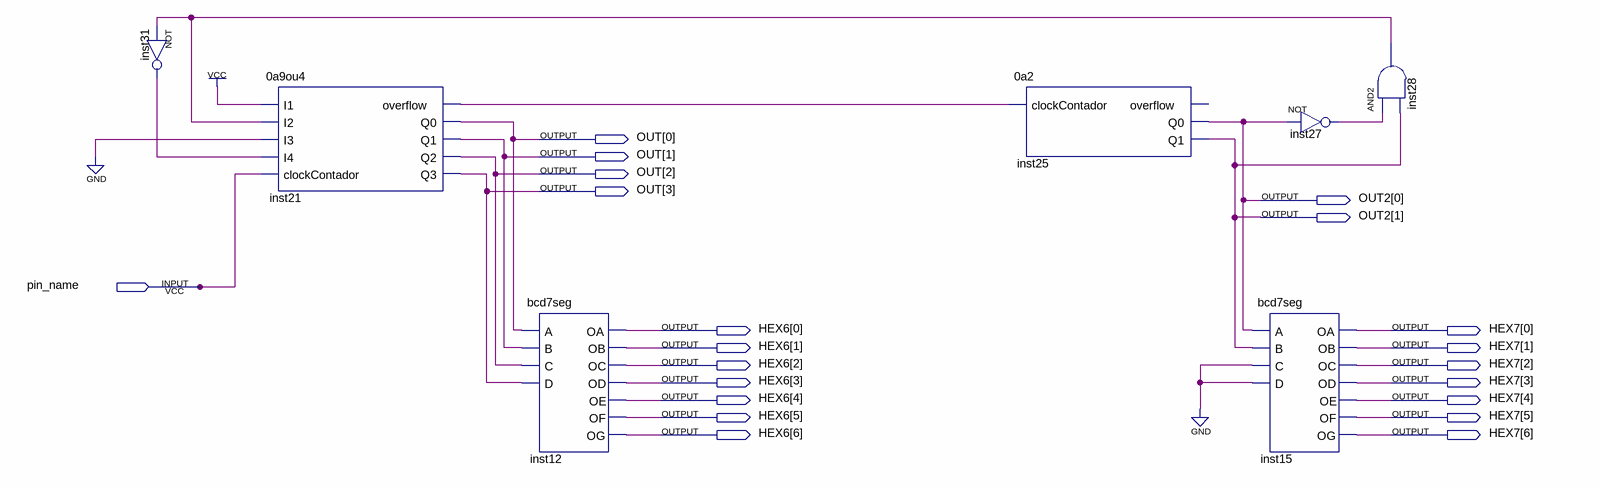
[diagram p0: schematic sheet]
// Quartus schematic exp13.bdf as structural Verilog: 7 symbols, 21 pins
module exp13 (
  input  pin_name,
  output [3:0] OUT,
  output [1:0] OUT2,
  output [6:0] HEX6,
  output [6:0] HEX7
);

  wire inst21_overflow, inst27_out, inst28_out, inst31_out;

  not inst31 (inst31_out, inst28_out);
  \0a9ou4  inst21 (
    .I1(1'b1), .I2(inst28_out), .I3(1'b0), .I4(inst31_out), .clockContador(pin_name),
    .overflow(inst21_overflow), .Q0(OUT[0]), .Q1(OUT[1]), .Q2(OUT[2]), .Q3(OUT[3]));
  bcd7seg inst12 (
    .A(OUT[0]), .B(OUT[1]), .C(OUT[2]), .D(OUT[3]), .OA(HEX6[0]), .OB(HEX6[1]), .OC(HEX6[2]), .OD(HEX6[3]),
    .OE(HEX6[4]), .OF(HEX6[5]), .OG(HEX6[6]));
  \0a2  inst25 (.clockContador(inst21_overflow), .Q0(OUT2[0]), .Q1(OUT2[1]));  // open: overflow
  not inst27 (inst27_out, OUT2[0]);
  bcd7seg inst15 (
    .A(OUT2[0]), .B(OUT2[1]), .C(1'b0), .D(1'b0), .OA(HEX7[0]), .OB(HEX7[1]), .OC(HEX7[2]), .OD(HEX7[3]),
    .OE(HEX7[4]), .OF(HEX7[5]), .OG(HEX7[6]));
  and inst28 (inst28_out, inst27_out, OUT2[1]);
endmodule
